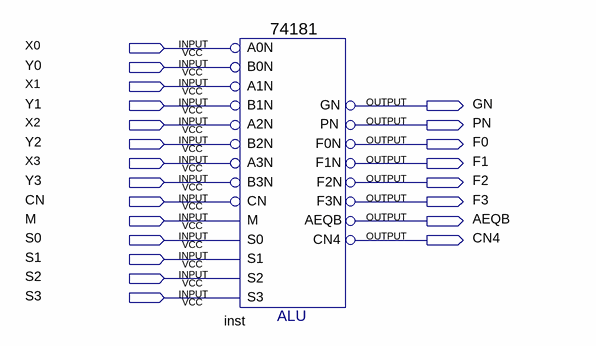
[diagram p0: schematic sheet]
// Quartus schematic 74181_only.bdf as structural Verilog: 1 symbols, 22 pins
module \74181_only  (
  input  X0,
  input  Y0,
  input  X1,
  input  Y1,
  input  X2,
  input  Y2,
  input  X3,
  input  Y3,
  input  CN,
  input  M,
  input  S0,
  input  S1,
  input  S2,
  input  S3,
  output GN,
  output PN,
  output F0,
  output F1,
  output F2,
  output F3,
  output AEQB,
  output CN4
);

  \74181  inst (
    .B0N(Y0), .A0N(X0), .A1N(X1), .B1N(Y1), .A3N(X3), .B2N(Y2), .A2N(X2), .M(M), .CN(CN), .B3N(Y3), .S2(S2),
    .S1(S1), .S0(S0), .S3(S3), .PN(PN), .GN(GN), .F3N(F3), .F1N(F1), .F0N(F0), .AEQB(AEQB), .CN4(CN4),
    .F2N(F2));
endmodule
